# Altium schematic sheet MIPI.SCHDOC
size A2
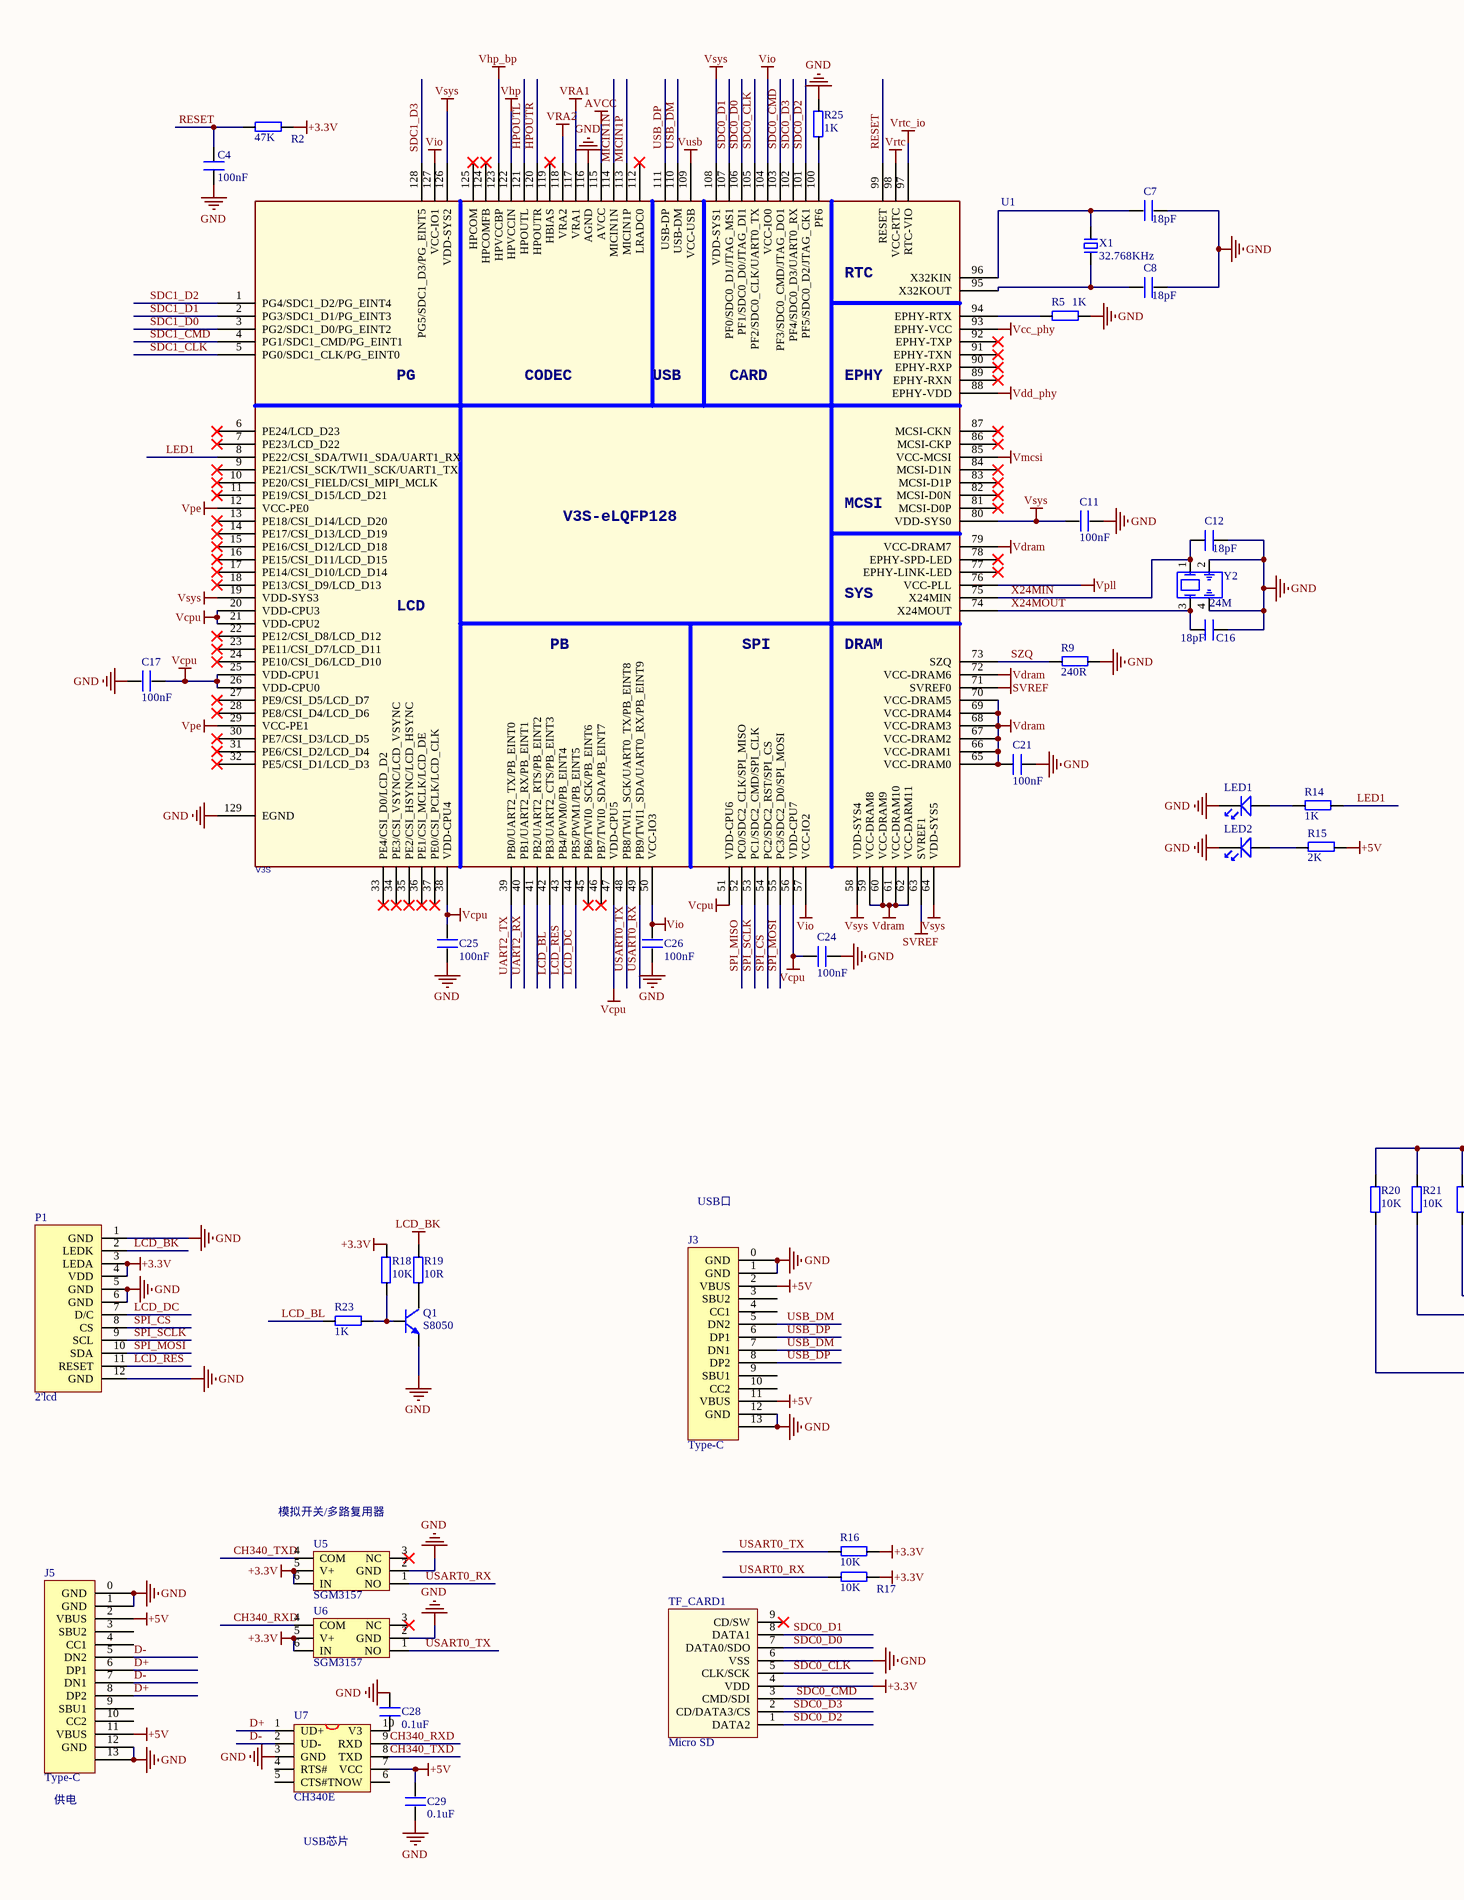
[diagram p0: MIPI.SCHDOC, left]
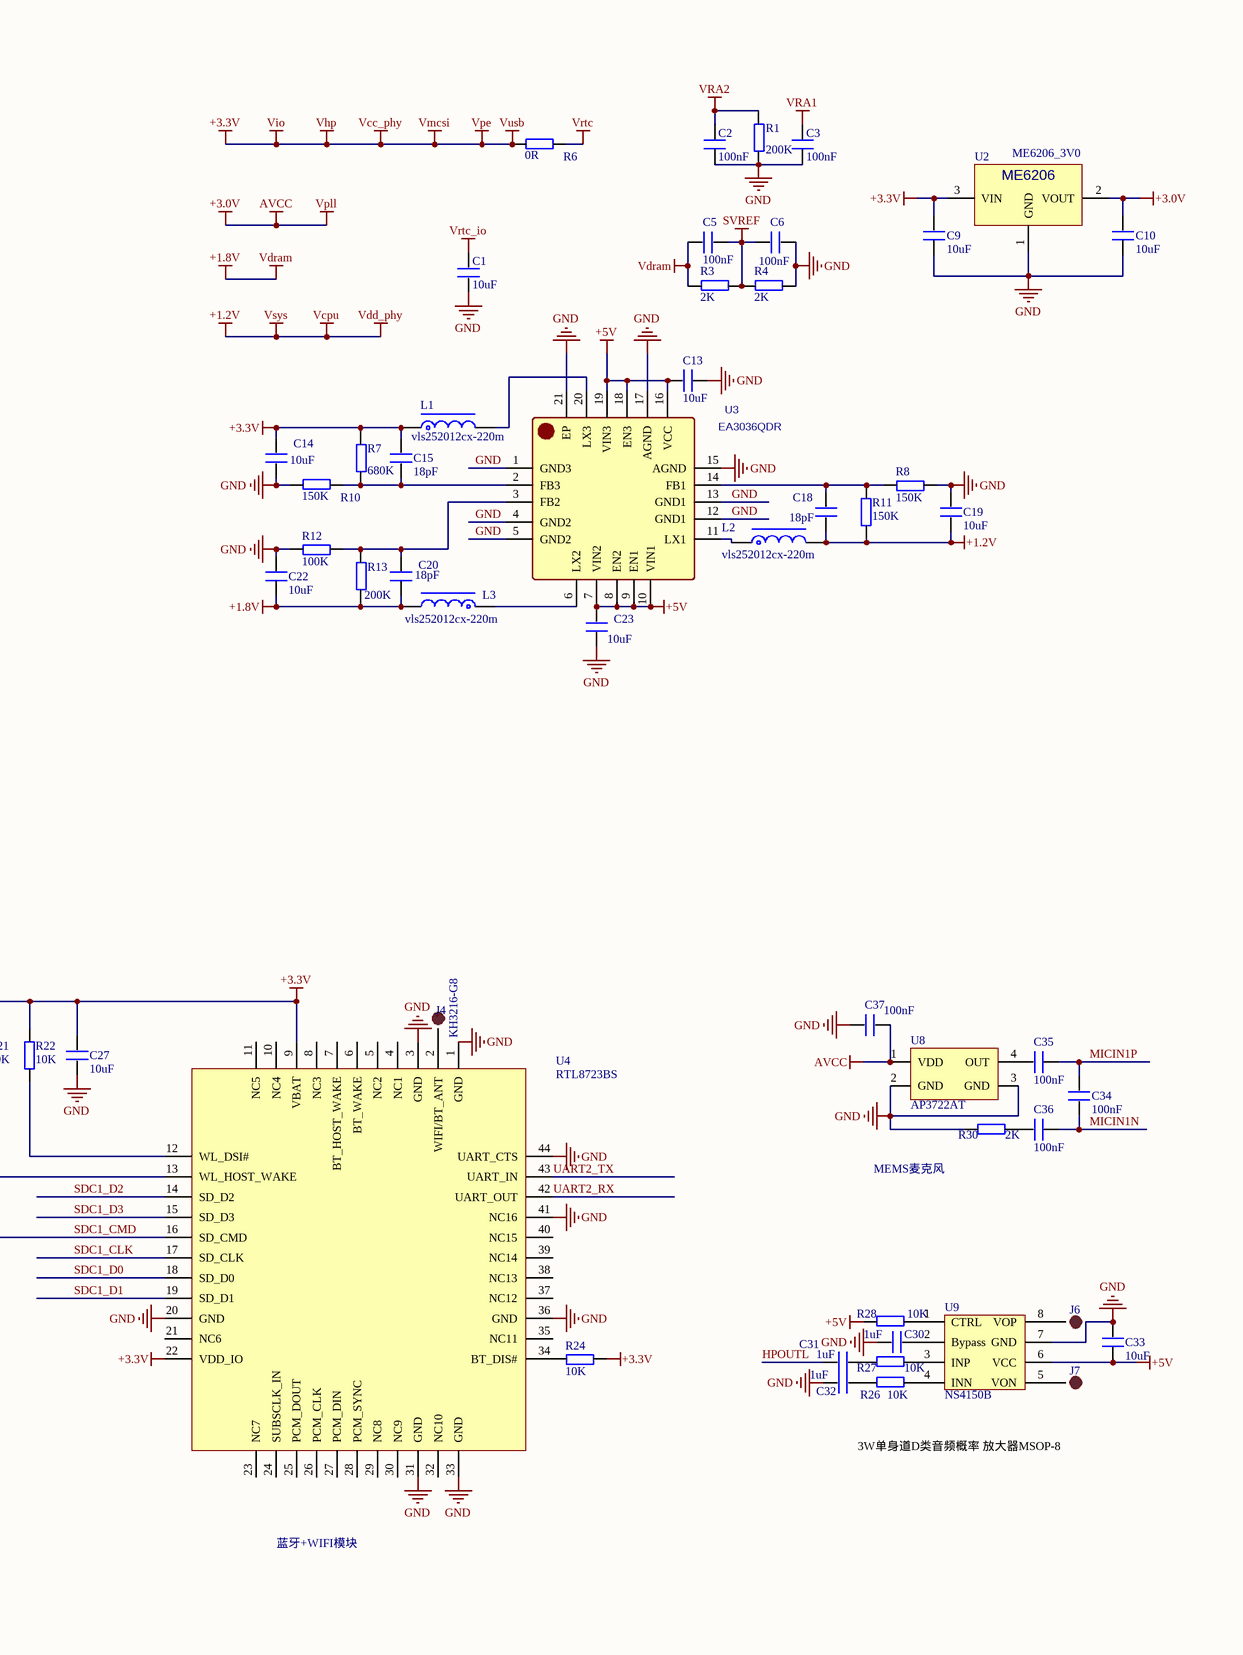
[diagram p1: MIPI.SCHDOC, right]

## Parts
C1  10uF  [0603]
C2  100nF  [0402]
C3  100nF  [0402]
C4  100nF  [0402]
C5  100nF  [0402]
C6  100nF  [0402]
C7  18pF  [0402]
C8  18pF  [0402]
C9  10uF  [0603]
C10  10uF  [0603]
C11  100nF  [0402]
C12  18pF  [0402]
C13  10uF  [0603]
C14  10uF  [0603]
C15  18pF  [0402]
C16  18pF  [0402]
C17  100nF  [0402]
C18  18pF  [0402]
C19  10uF  [0603]
C20  18pF  [0402]
C21  100nF  [0402]
C22  10uF  [0603]
C23  10uF  [0603]
C24  100nF  [0402]
C25  100nF  [0402]
C26  100nF  [0402]
C27  10uF  [0603]
C28  0.1uF  [0402]
C29  0.1uF  [0402]
C30  1uF  [0402]
C31  1uF  [0402]
C32  1uF  [0402]
C33  10uF  [0603]
C34  100nF  [0402]
C35  100nF  [0402]
C36  100nF  [0402]
C37  100nF  [0402]
J3  Type-C  [USB-C-SMD_TYC-302-16]
J4  KH3216-G8  [ANT-SMD_L3.2-W1.6]
J5  Type-C  [USB-C-SMD_TYC-302-16]
J6  (no value)  [TP-1.5]
J7  (no value)  [TP-1.5]
L1  vls252012cx-220m  [L1]
L2  vls252012cx-220m  [L1]
L3  vls252012cx-220m  [L1]
LED1  LED  [0603]  (value not drawn)
LED2  LED  [0603]  (value not drawn)
P1  2'lcd  [2'LCD]
Q1  S8050  [SOT23-3L]
R1  200K  [0402]
R2  47K  [0402]
R3  2K  [0402]
R4  2K  [0402]
R5  1K  [0402]
R6  0R  [0402]
R7  680K  [0402]
R8  150K  [0402]
R9  240R  [0402]
R10  150K  [0402]
R11  150K  [0402]
R12  100K  [0402]
R13  200K  [0402]
R14  1K  [0402]
R15  2K  [0402]
R16  10K  [0402]
R17  10K  [0402]
R18  10K  [0402]
R19  10R  [0603]
R20  10K  [0402]
R21  10K  [0402]
R22  10K  [0402]
R23  1K  [0402]
R24  10K  [0402]
R25  1K  [0402]
R26  10K  [0402]
R27  10K  [0402]
R28  10K  [0402]
R30  2K  [0402]
TF_CARD1  Micro SD  [Micro SD]
U1  V3S  [LQFP-128]
U2  ME6206_3V0  [SOT-23]
U3  EA3036QDR  [TQFN-20]
U4  RTL8723BS  [RTL8723BS]
U5  SGM3157  [SOT363-6L]
U6  SGM3157  [SOT363-6L]
U7  CH340E  [MSOP-10]
U8  AP3722AT  [AP3722AT]
U9  NS4150B  [MSOP8]
X1  32.768KHz  [XT_3215_2]
Y2  24M  [X3225]

## Nets
+1.2V: C11.2 C17.1 C18.2 C19.2 C24.2 C25.1 L2.2 R11.2 U1.19(VDD-SYS3) U1.20(VDD-CPU3) U1.21(VDD-CPU2) U1.25(VDD-CPU1) U1.26(VDD-CPU0) U1.38(VDD-CPU4) U1.47(VDD-CPU5) U1.51(VDD-CPU6) U1.56(VDD-CPU7) U1.58(VDD-SYS4) U1.64(VDD-SYS5) U1.80(VDD-SYS0) U1.88(EPHY-VDD) U1.108(VDD-SYS1) U1.126(VDD-SYS2)  [also labelled Vcpu, Vdd_phy, Vsys]
+1.8V: C5.2 C20.2 C21.2 C22.2 L3.2 R3.2 R13.2 U1.59(VCC-DRAM8) U1.60(VCC-DRAM9) U1.61(VCC-DRAM10) U1.62(VCC-DARM11) U1.65(VCC-DRAM0) U1.66(VCC-DRAM1) U1.67(VCC-DRAM2) U1.68(VCC-DRAM3) U1.69(VCC-DRAM4) U1.70(VCC-DRAM5) U1.72(VCC-DRAM6) U1.79(VCC-DRAM7)  [also labelled Vdram]
+3.0V: C10.1 C37.1 U1.76(VCC-PLL) U1.115(AVCC) U2.2(VOUT) U8.1(VDD)  [also labelled AVCC, Vpll]
+3.3V: C9.1 C14.2 C15.2 C26.2 C27.1 L1.1 P1.3(LEDA) P1.4(VDD) R2.1 R6.2 R7.2 R16.1 R17.1 R18.1 R20.1 R21.1 R22.1 R24.2 TF_CARD1.4(VDD) U1.12(VCC-PE0) U1.29(VCC-PE1) U1.50(VCC-IO3) U1.57(VCC-IO2) U1.85(VCC-MCSI) U1.93(EPHY-VCC) U1.104(VCC-IO0) U1.109(VCC-USB) U1.122(HPVCCIN) U1.127(VCC-IO1) U2.3(VIN) U4.9(VBAT) U4.22(VDD_IO) U5.5(V+) U5.6(IN) U6.5(V+) U6.6(IN)  [also labelled Vcc_phy, Vhp, Vio, Vmcsi, Vpe, Vusb]
+5V: C13.2 C23.2 C29.2 C33.1 J3.2(VBUS) J3.11(VBUS) J5.2(VBUS) J5.11(VBUS) R15.1 R28.2 U3.7(VIN2) U3.8(EN2) U3.9(EN1) U3.10(VIN1) U3.16(VCC) U3.18(EN3) U3.19(VIN3) U7.7(VCC) U9.6(VCC)
GND: C1.2 C2.1 C3.1 C4.1 C6.1 C7.2 C8.2 C9.2 C10.2 C11.1 C12.2 C13.1 C14.1 C16.2 C17.2 C19.1 C21.1 C22.1 C23.1 C24.1 C25.2 C26.1 C27.2 C28.2 C29.1 C30.2 C32.2 C33.2 C37.2 J3.0(GND) J3.1(GND) J3.12(GND) J3.13 J5.0(GND) J5.1(GND) J5.12(GND) J5.13 LED1.2 LED2.2 P1.1(GND) P1.5(GND) P1.6(GND) P1.12(GND) Q1.2(E) R1.1 R4.1 R5.1 R8.2 R9.1 R10.2 R12.2 R25.1 R30.2 TF_CARD1.6(VSS) U1.116(AGND) U1.129(EGND) U2.1(GND) U3.1(GND3) U3.4(GND2) U3.5(GND2) U3.12(GND1) U3.13(GND1) U3.15(AGND) U3.17(AGND) U3.21(EP) U4.1(GND) U4.3(GND) U4.20(GND) U4.31(GND) U4.33(GND) U4.36(GND) U4.41(NC16) U4.44(UART_CTS) U5.2(GND) U6.2(GND) U7.3(GND) U8.2(GND) U8.3(GND) U9.7(GND) Y2.2(GND) Y2.4(GND)
LCD_BK: P1.2(LEDK) R19.1
SVREF: C5.1 C6.2 R3.1 R4.2 U1.63(SVREF1) U1.71(SVREF0)
Vhp_bp: U1.123(HPVCCBP)
VRA1: C3.2 U1.117(VRA1)
VRA2: C2.2 R1.2 U1.118(VRA2)
Vrtc: R6.1 U1.98(VCC-RTC)
Vrtc_io: C1.1 U1.97(RTC-VIO)
CH340_RXD: U6.4(COM) U7.9(RXD)
CH340_TXD: U5.4(COM) U7.8(TXD)
D+: J5.6(DP1) J5.8(DP2) U7.1(UD+)
D-: J5.5(DN2) J5.7(DN1) U7.2(UD-)
HPOUTL: C31.2 U1.121(HPOUTL)
HPOUTR: U1.120(HPOUTR)
LCD_BL: R23.2 U1.42(PB3/UART2_CTS/PB_EINT3)
LCD_DC: P1.7(D/C) U1.44(PB5/PWM1/PB_EINT5)
LCD_RES: P1.11(RESET) U1.43(PB4/PWM0/PB_EINT4)
LED1: R14.1 U1.8(PE22/CSI_SDA/TWI1_SDA/UART1_RX)
MICIN1N: C34.2 C36.2 U1.114(MICIN1N)
MICIN1P: C34.1 C35.2 U1.113(MICIN1P)
RESET: C4.2 R2.2 U1.99(RESET)
SDC0_CLK: TF_CARD1.5(CLK/SCK) U1.105(PF2/SDC0_CLK/UART0_TX)
SDC0_CMD: TF_CARD1.3(CMD/SDI) U1.103(PF3/SDC0_CMD/JTAG_DO1)
SDC0_D0: TF_CARD1.7(DATA0/SDO) U1.106(PF1/SDC0_D0/JTAG_DI1)
SDC0_D1: TF_CARD1.8(DATA1) U1.107(PF0/SDC0_D1/JTAG_MS1)
SDC0_D2: TF_CARD1.1(DATA2) U1.101(PF5/SDC0_D2/JTAG_CK1)
SDC0_D3: TF_CARD1.2(CD/DATA3/CS) U1.102(PF4/SDC0_D3/UART0_RX)
SDC1_CLK: U1.5(PG0/SDC1_CLK/PG_EINT0) U4.17(SD_CLK)
SDC1_CMD: R20.2 U1.4(PG1/SDC1_CMD/PG_EINT1) U4.16(SD_CMD)
SDC1_D0: U1.3(PG2/SDC1_D0/PG_EINT2) U4.18(SD_D0)
SDC1_D1: U1.2(PG3/SDC1_D1/PG_EINT3) U4.19(SD_D1)
SDC1_D2: U1.1(PG4/SDC1_D2/PG_EINT4) U4.14(SD_D2)
SDC1_D3: U1.128(PG5/SDC1_D3/PG_EINT5) U4.15(SD_D3)
SPI_CS: P1.8(CS) U1.54(PC2/SDC2_RST/SPI_CS)
SPI_MISO: U1.52(PC0/SDC2_CLK/SPI_MISO)
SPI_MOSI: P1.10(SDA) U1.55(PC3/SDC2_D0/SPI_MOSI)
SPI_SCLK: P1.9(SCL) U1.53(PC1/SDC2_CMD/SPI_CLK)
SZQ: R9.2 U1.73(SZQ)
UART2_RX: U1.40(PB1/UART2_RX/PB_EINT1) U4.42(UART_OUT)
UART2_TX: U1.39(PB0/UART2_TX/PB_EINT0) U4.43(UART_IN)
USART0_RX: R17.2 U1.49(PB9/TWI1_SDA/UART0_RX/PB_EINT9) U5.1(NO)
USART0_TX: R16.2 U1.48(PB8/TWI1_SCK/UART0_TX/PB_EINT8) U6.1(NO)
USB_DM: J3.5(DN2) J3.7(DN1) U1.110(USB-DM)
USB_DP: J3.6(DP1) J3.8(DP2) U1.111(USB-DP)
X24MIN: C12.1 U1.75(X24MIN) Y2.1(OSC1)
X24MOUT: C16.1 U1.74(X24MOUT) Y2.3(OSC2)
NetC7_1: C7.1 U1.96(X32KIN) X1.2
NetC8_1: C8.1 U1.95(X32KOUT) X1.1
NetC15_1: C15.1 R7.1 R10.1 U3.2(FB3)
NetC18_1: C18.1 R8.1 R11.1 U3.14(FB1)
NetC20_1: C20.1 R12.1 R13.1 U3.3(FB2)
NetC28_1: C28.1 U7.10(V3)
NetC30_1: C30.1 U9.2(Bypass)
NetC31_1: C31.1 R27.2
NetC32_1: C32.1 R26.2
NetC35_1: C35.1 U8.4(OUT)
NetC36_1: C36.1 R30.1
NetJ4_1: J4.1 U4.2(WIFI/BT_ANT)
NetJ6_1: J6.1 U9.8(VOP)
NetJ7_1: J7.1 U9.5(VON)
NetL1_2: L1.2 U3.20(LX3)
NetL2_1: L2.1 U3.11(LX1)
NetL3_1: L3.1 U3.6(LX2)
NetLED1_1: LED1.1 R14.2
NetLED2_1: LED2.1 R15.2
NetQ1_1: Q1.1(B) R18.2 R23.1
NetQ1_3: Q1.3(C) R19.2
NetR5_2: R5.2 U1.94(EPHY-RTX)
NetR21_2: R21.2 U4.13(WL_HOST_WAKE)
NetR22_2: R22.2 U4.12(WL_DSI#)
NetR24_1: R24.1 U4.34(BT_DIS#)
NetR25_2: R25.2 U1.100(PF6)
NetR26_1: R26.1 U9.4(INN)
NetR27_1: R27.1 U9.3(INP)
NetR28_1: R28.1 U9.1(CTRL)

Not connected (* = marked no-connect by the designer): J3 3(SBU2) 4(CC1) 9(SBU1) 10(CC2); J5 3(SBU2) 4(CC1) 9(SBU1) 10(CC2); TF_CARD1 9(CD/SW)*; U1 6(PE24/LCD_D23)* 7(PE23/LCD_D22)* 9(PE21/CSI_SCK/TWI1_SCK/UART1_TX)* 10(PE20/CSI_FIELD/CSI_MIPI_MCLK)* 11(PE19/CSI_D15/LCD_D21)* 13(PE18/CSI_D14/LCD_D20)* 14(PE17/CSI_D13/LCD_D19)* 15(PE16/CSI_D12/LCD_D18)* 16(PE15/CSI_D11/LCD_D15)* 17(PE14/CSI_D10/LCD_D14)* 18(PE13/CSI_D9/LCD_D13)* 22(PE12/CSI_D8/LCD_D12)* 23(PE11/CSI_D7/LCD_D11)* 24(PE10/CSI_D6/LCD_D10)* 27(PE9/CSI_D5/LCD_D7)* 28(PE8/CSI_D4/LCD_D6)* 30(PE7/CSI_D3/LCD_D5)* 31(PE6/CSI_D2/LCD_D4)* 32(PE5/CSI_D1/LCD_D3)* 33(PE4/CSI_D0/LCD_D2)* 34(PE3/CSI_VSYNC/LCD_VSYNC)* 35(PE2/CSI_HSYNC/LCD_HSYNC)* 36(PE1/CSI_MCLK/LCD_DE)* 37(PE0/CSI_PCLK/LCD_CLK)* 41(PB2/UART2_RTS/PB_EINT2) 45(PB6/TWI0_SCK/PB_EINT6)* 46(PB7/TWI0_SDA/PB_EINT7)* 77(EPHY-LINK-LED)* 78(EPHY-SPD-LED)* 81(MCSI-D0P)* 82(MCSI-D0N)* 83(MCSI-D1P)* 84(MCSI-D1N)* 86(MCSI-CKP)* 87(MCSI-CKN)* 89(EPHY-RXN)* 90(EPHY-RXP)* 91(EPHY-TXN)* 92(EPHY-TXP)* 112(LRADC0)* 119(HBIAS)* 124(HPCOMFB)* 125(HPCOM)*; U4 4(NC1) 5(NC2) 6(BT_WAKE) 7(BT_HOST_WAKE) 8(NC3) 10(NC4) 11(NC5) 21(NC6) 23(NC7) 24(SUBSCLK_IN) 25(PCM_DOUT) 26(PCM_CLK) 27(PCM_DIN) 28(PCM_SYNC) 29(NC8) 30(NC9) 32(NC10) 35(NC11) 37(NC12) 38(NC13) 39(NC14) 40(NC15); U5 3(NC)*; U6 3(NC)*; U7 4(RTS#) 5(CTS#) 6(TNOW)

## Notes on the sheet
- USB口
- MEMS麦克风
- (near U5) 模拟开关/多路复用器
- 3W单身道D类音频概率 放大器MSOP-8
- 蓝牙+WIFI模块
- (near J5) 供电
- USB芯片
- (in symbol V3S) RTC; PG; CODEC; USB; CARD; EPHY; MCSI; V3S-eLQFP128; SYS; LCD; PB; SPI; DRAM

## Library data of the parts
C1-C37 = C
J3 J5 = Type-C_12pin
J4 J6 J7 = TEST-POINT: 测试点
L1-L3 = L-CDRH: 功率屏蔽电感; 版权归属: 源创客; BOM名称: 功率屏蔽电感; 学习资源: www.ooocke.com
Q1 = 8050-SMD: 高频放大-NPN型; BOM名称: 高频放大-PNP型; 版权归属: 源创客; 属性: 40V 1.5A 1W 100MHZ; 学习资源: www.ooocke.com
R1-R28 R30 = R
TF_CARD1 = Micro SD: Micro SD卡; 版权归属: 源创客; BOM名称: Micro SD卡; 学习资源: www.ooocke.com
U2 = ME6206
U3 = EA3036QDR: BOM_Manufacturer: Everanalog; spicePre: X; BOM_Manufacturer Part: EA3036QDR; BOM_Supplier: LCSC; BOM_Supplier Part: C111587
U5 U6 = SGM3157: 单路双掷模拟开关
U7 = CH340E: USB2UART
X1 = XTAL-2P: 2脚无源晶振; BOM名称: 2脚晶振; 版权归属: 源创客; 学习资源: www.ooocke.com
Y2 = SMD XTAL